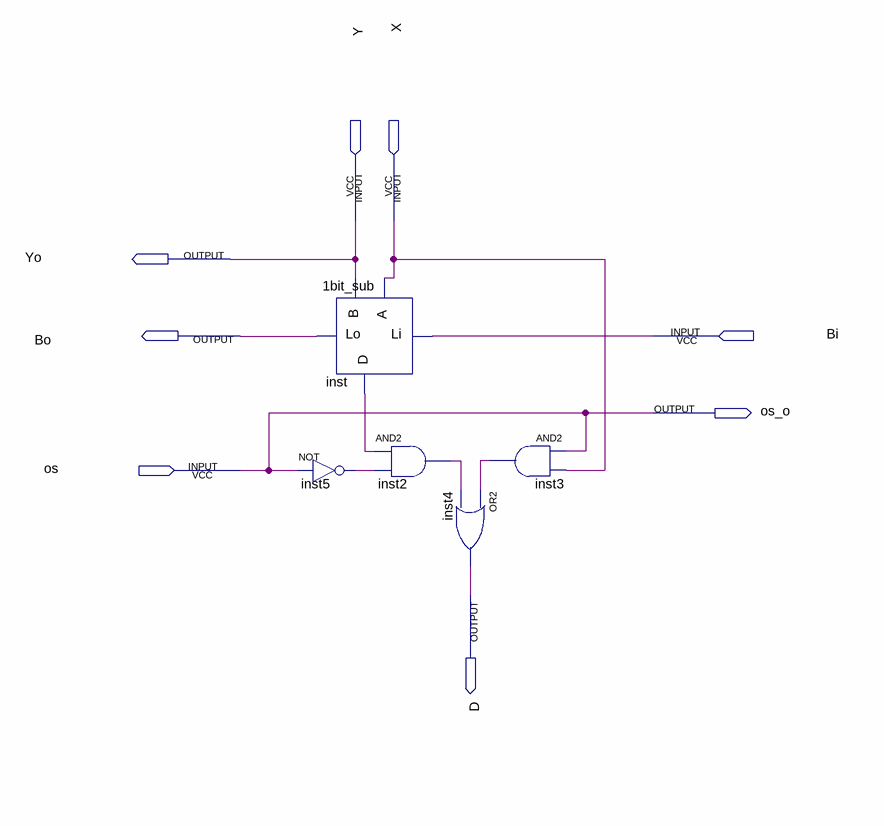
[diagram p0: schematic sheet]
// Quartus schematic 1bit_div.bdf as structural Verilog: 5 symbols, 8 pins
module \1bit_div  (
  input  Y,
  input  X,
  input  Bi,
  input  os,
  output Yo,
  output Bo,
  output os_o,
  output D
);

  wire inst2_out, inst3_out, inst5_out, inst_d;

  \1bit_sub  inst (.A(X), .B(Y), .Li(Bi), .Lo(Bo), .D(inst_d));
  not inst5 (inst5_out, os);
  and inst2 (inst2_out, inst_d, inst5_out);
  and inst3 (inst3_out, os, X);
  or inst4 (D, inst3_out, inst2_out);

  assign os_o = os;
  assign Yo = Y;
endmodule
